# EAGLE design GB-BRK-F (EAGLE 7.3.0)
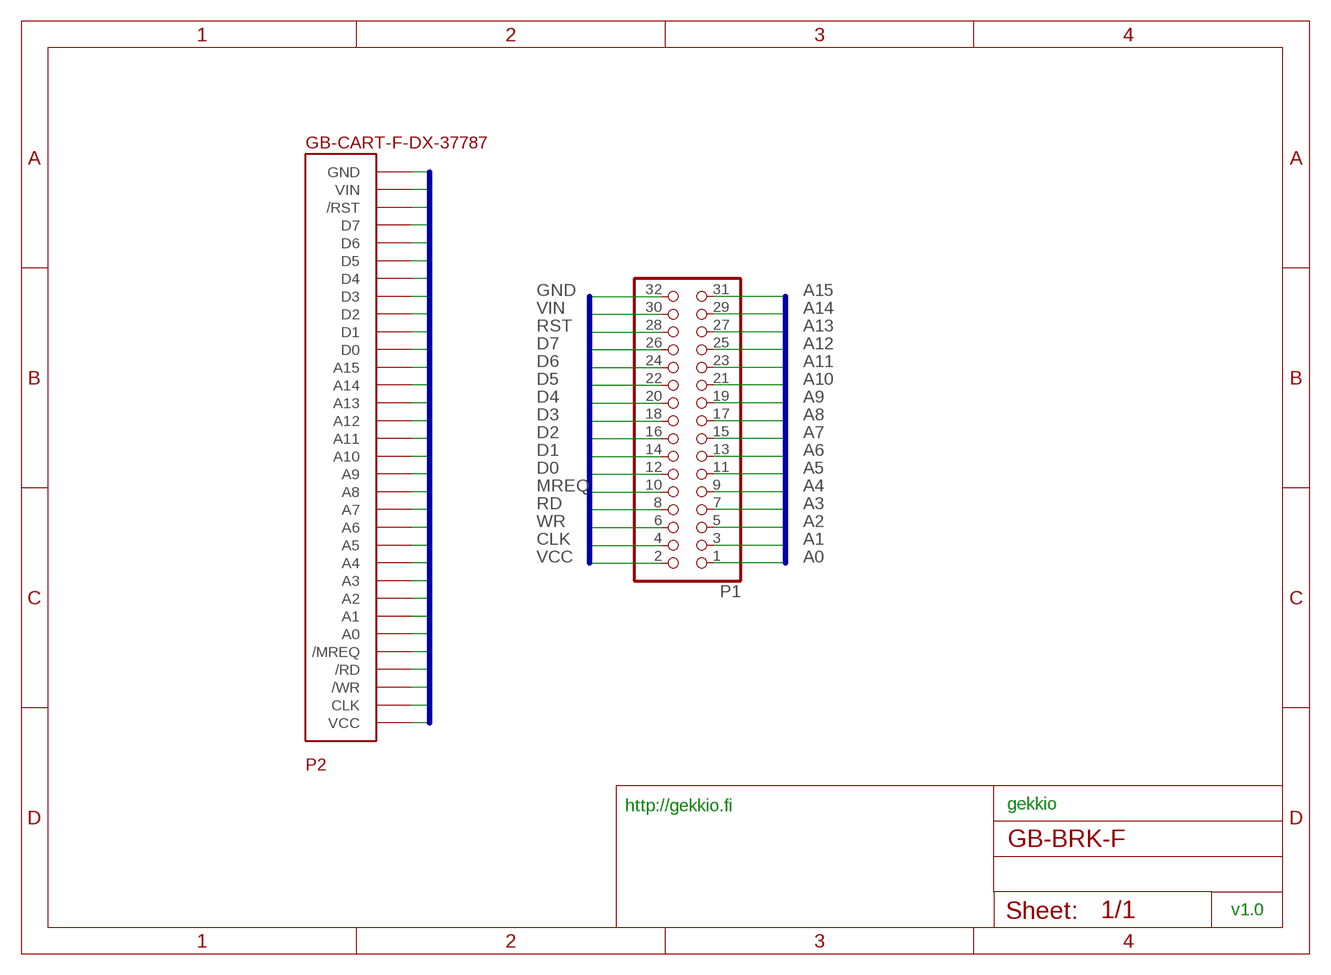
[diagram p0: schematic, sheet 1]

## Parts
P1  PINHD-2X16  [2X16]
P2  GB-CART-F-DX-37787  [DX-37787-GB]

## Nets
A0: P1.1 P2.6(A0)
A1: P1.3 P2.7(A1)
A2: P1.5 P2.8(A2)
A3: P1.7 P2.9(A3)
A4: P1.9 P2.10(A4)
A5: P1.11 P2.11(A5)
A6: P1.13 P2.12(A6)
A7: P1.15 P2.13(A7)
A8: P1.17 P2.14(A8)
A9: P1.19 P2.15(A9)
A10: P1.21 P2.16(A10)
A11: P1.23 P2.17(A11)
A12: P1.25 P2.18(A12)
A13: P1.27 P2.19(A13)
A14: P1.29 P2.20(A14)
A15: P1.31 P2.21(A15)
CLK: P1.4 P2.2(CLK)
D0: P1.12 P2.22(D0)
D1: P1.14 P2.23(D1)
D2: P1.16 P2.24(D2)
D3: P1.18 P2.25(D3)
D4: P1.20 P2.26(D4)
D5: P1.22 P2.27(D5)
D6: P1.24 P2.28(D6)
D7: P1.26 P2.29(D7)
GND: P1.32 P2.32(GND)
MREQ: P1.10 P2.5(/MREQ)
RD: P1.8 P2.4(/RD)
RST: P1.28 P2.30(/RST)
VCC: P1.2 P2.1(VCC)
VIN: P1.30 P2.31(VIN)
WR: P1.6 P2.3(/WR)

## Buses
VCC,CLK,WR,RD,MREQ,A[0..15],D[0..7],RST,VIN,GND

## Notes on the sheet
- http://gekkio.fi | gekkio
- v1.0

## Library data of the parts
P1 = pinhead:PINHD-2X16: PIN HEADER
P2 = Gameboy:GB-CART-F-DX-37787

## Board
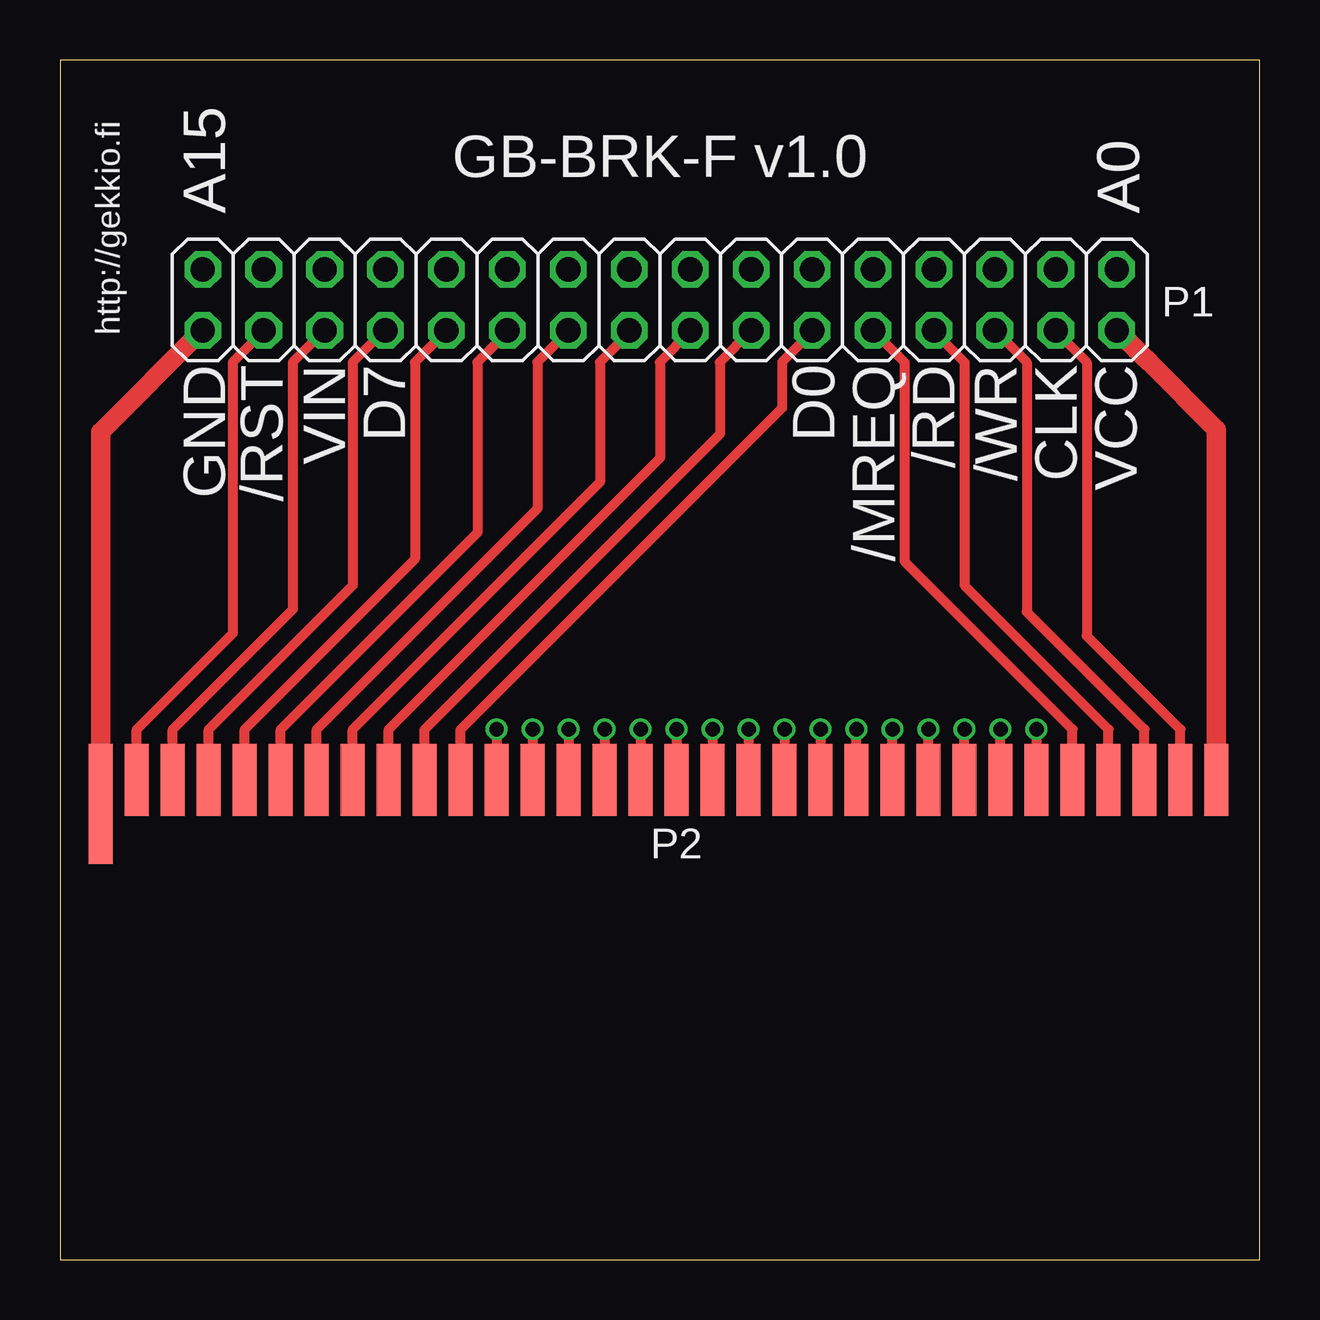
[diagram p1: board, top side]
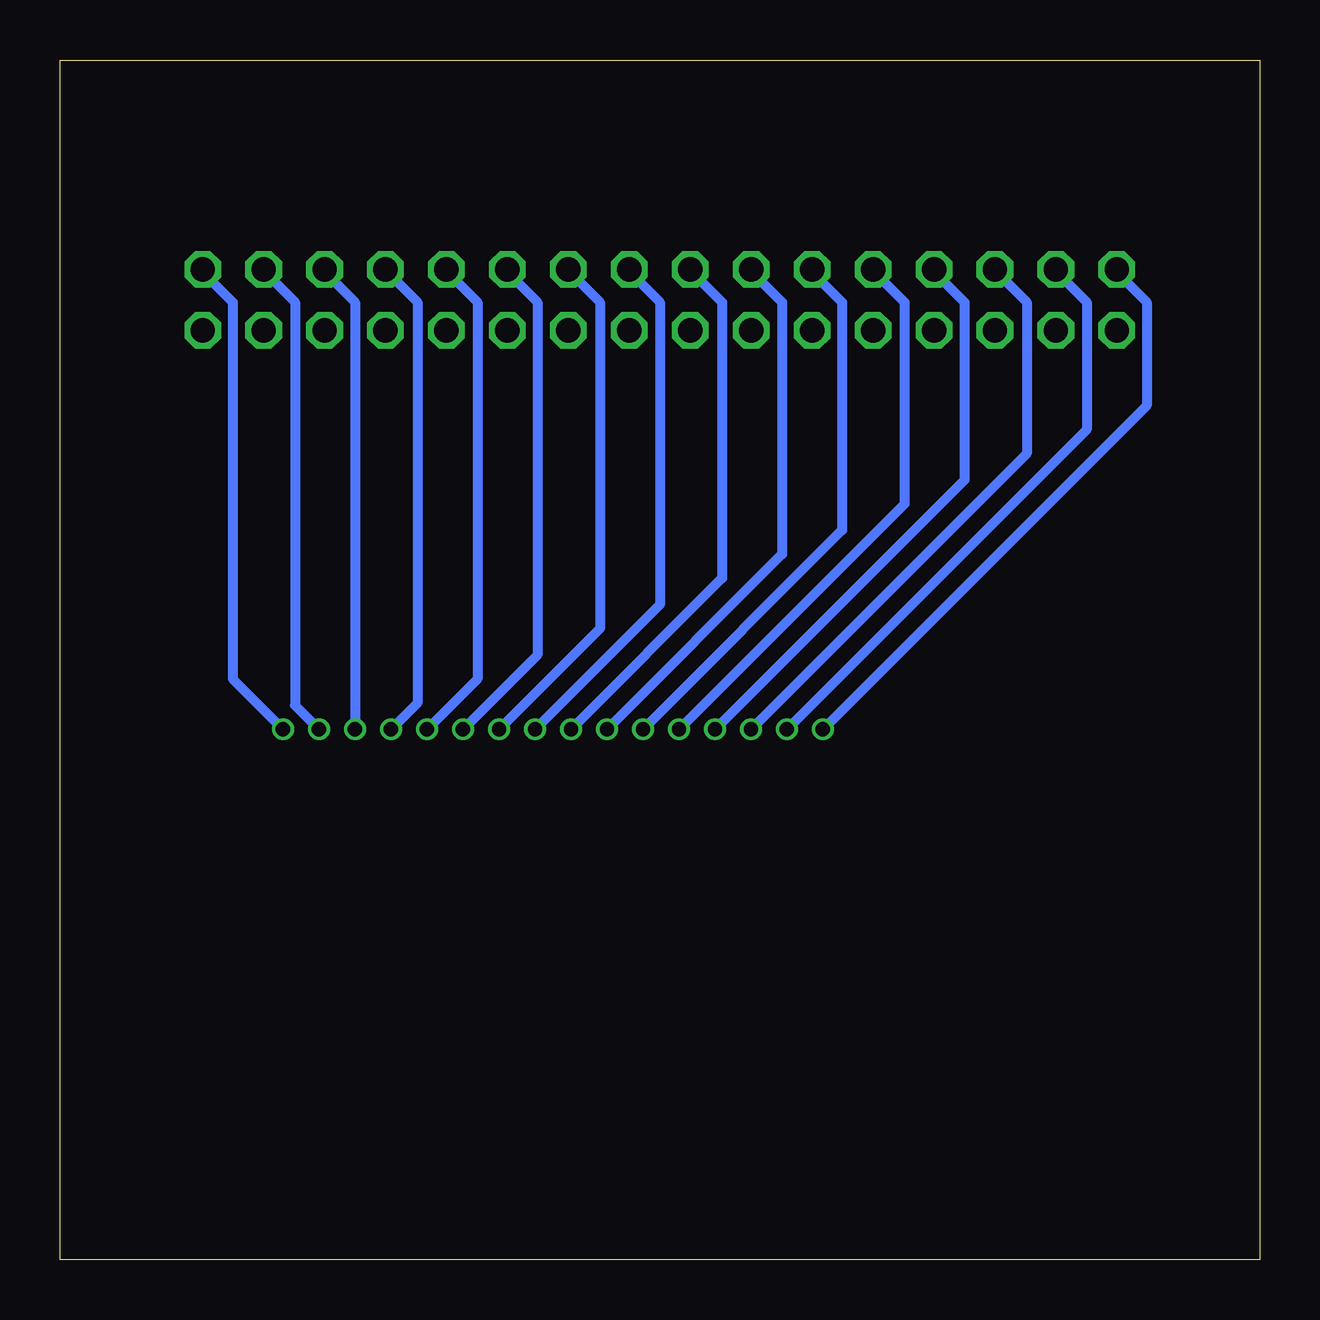
[diagram p2: board, bottom side, seen from below]

Size 50 x 50 mm. Coordinates in mm from the lower left corner, seen from the top.
Outline: 0,0 50,0 50,50 0,50 0,0
Copper layers (1*16): Top 0.035mm / dielectric 1.5mm / Bottom 0.035mm
Design rules "Elecrow_2-layer_eagle_rule *": minimum track width 6mil, minimum drill 12mil, track to track 6mil, track to pad 6mil, pad to pad 6mil, via to via 6mil, smd to smd 0mil, copper to edge 10mil, drill to drill 10mil, minimum pad ring 10mil, minimum via ring 6mil, stop-mask expansion 2mil, vias tented up to drill 100mil, thermal gap 10mil

### Footprints (pad centres in the part's own frame; a part is rotated, then mirrored left to right if it is on the bottom)
2X16 = drill 1.016 octagon: 1 -19.05,-1.27; 2 -19.05,1.27; 3 -16.51,-1.27; 4 -16.51,1.27; 5 -13.97,-1.27; 6 -13.97,1.27; 7 -11.43,-1.27; 8 -11.43,1.27; 9 -8.89,-1.27; 10 -8.89,1.27; 11 -6.35,-1.27; 12 -6.35,1.27; 13 -3.81,-1.27; 14 -3.81,1.27; 15 -1.27,-1.27; 16 -1.27,1.27; 17 1.27,-1.27; 18 1.27,1.27; 19 3.81,-1.27; 20 3.81,1.27; 21 6.35,-1.27; 22 6.35,1.27; 23 8.89,-1.27; 24 8.89,1.27; 25 11.43,-1.27; 26 11.43,1.27; 27 13.97,-1.27; 28 13.97,1.27; 29 16.51,-1.27; 30 16.51,1.27; 31 19.05,-1.27; 32 19.05,1.27
DX-37787-GB = smd 3 x 1: 1 0,22.5; 2 0,21; 3 0,19.5; 4 0,18; 5 0,16.5; 6 0,15; 7 0,13.5; 8 0,12; 9 0,10.5; 10 0,9; 11 0,7.5; 12 0,6; 13 0,4.5; 14 0,3; 15 0,1.5; 16 0,0; 17 0,-1.5; 18 0,-3; 19 0,-4.5; 20 0,-6; 21 0,-7.5; 22 0,-9; 23 0,-10.5; 24 0,-12; 25 0,-13.5; 26 0,-15; 27 0,-16.5; 28 0,-18; 29 0,-19.5; 30 0,-21; 31 0,-22.5 | smd 5 x 1: 32 1,-24

### Placement (x,y rotation side)
P1  25,40 180 top
P2  25.7,20 270 top

### Tracks (layer width: path | path; a pad name or v marks a point on that pad's centre or on a via)
A0  (via drill 0.6)
  Top 0.406: v40.7,22.1 P2.6
  Bottom 0.406: P1.1 44.05,41.15 42.8,39.9 42.8,24.2 v40.7,22.1
A1  (via drill 0.6)
  Top 0.406: P2.7 v39.2,22.1
  Bottom 0.406: P1.3 41.51,41.21 40.2,39.9 40.2,23.1 v39.2,22.1
A2  (via drill 0.6)
  Top 0.406: P2.8 v37.7,22.1
  Bottom 0.406: P1.5 38.97,41.17 37.7,39.9 v37.7,22.1
A3  (via drill 0.6)
  Top 0.406: P2.9 v36.2,22.1
  Bottom 0.406: P1.7 36.43,41.23 35.1,39.9 35.1,23.2 v36.2,22.1
A4  (via drill 0.6)
  Top 0.406: P2.10 v34.7,22.1
  Bottom 0.406: P1.9 33.89,41.19 32.6,39.9 32.6,24.2 v34.7,22.1
A5  (via drill 0.6)
  Top 0.406: P2.11 v33.2,22.1
  Bottom 0.406: P1.11 31.35,41.15 30.1,39.9 30.1,25.2 v33.2,22.1
A6  (via drill 0.6)
  Top 0.406: v31.7,22.1 P2.12
  Bottom 0.406: P1.13 28.81,41.21 27.5,39.9 27.5,26.3 v31.7,22.1
A7  (via drill 0.6)
  Top 0.406: v30.2,22.1 P2.13
  Bottom 0.406: P1.15 26.27,41.17 25,39.9 25,27.3 v30.2,22.1
A8  (via drill 0.6)
  Top 0.406: v28.7,22.1 P2.14
  Bottom 0.406: P1.17 23.73,41.23 22.4,39.9 22.4,28.4 v28.7,22.1
A9  (via drill 0.6)
  Top 0.406: v27.2,22.1 P2.15
  Bottom 0.406: P1.19 21.19,41.19 19.9,39.9 19.9,29.4 v27.2,22.1
A10  (via drill 0.6)
  Top 0.406: v25.7,22.1 P2.16
  Bottom 0.406: P1.21 18.65,41.15 17.4,39.9 17.4,30.4 v25.7,22.1
A11  (via drill 0.6)
  Top 0.406: v24.2,22.1 P2.17
  Bottom 0.406: P1.23 16.11,41.21 14.8,39.9 14.8,31.5 v24.2,22.1
A12  (via drill 0.6)
  Top 0.406: v22.7,22.1 P2.18
  Bottom 0.406: P1.25 13.57,41.17 12.3,39.9 12.3,32.5 v22.7,22.1
A13  (via drill 0.6)
  Top 0.406: v21.2,22.1 P2.19
  Bottom 0.406: P1.27 11.03,41.23 9.7,39.9 9.7,33.6 v21.2,22.1
A14  (via drill 0.6)
  Top 0.406: v19.7,22.1 P2.20
  Bottom 0.406: P1.29 8.49,41.19 7.2,39.9 7.2,34.6 v19.7,22.1
A15  (via drill 0.6)
  Top 0.406: v18.2,22.1 P2.21
  Bottom 0.406: P1.31 5.95,41.15 4.7,39.9 4.7,35.6 v18.2,22.1
CLK
  Top 0.406: P1.4 41.51,38.69 42.8,37.4 42.8,26 46.7,22.1 P2.2
D0
  Top 0.406: P1.12 31.35,38.65 30.1,37.4 30.1,35.5 16.7,22.1 P2.22
D1
  Top 0.406: P1.14 28.81,38.71 27.5,37.4 27.5,34.4 15.2,22.1 P2.23
D2
  Top 0.406: P1.16 26.27,38.67 25,37.4 25,33.4 13.7,22.1 P2.24
D3
  Top 0.406: P1.18 23.73,38.63 22.5,37.4 22.5,32.4 12.2,22.1 P2.25
D4
  Top 0.406: P1.20 21.19,38.69 19.9,37.4 19.9,31.3 10.7,22.1 P2.26
D5
  Top 0.406: P1.22 18.65,38.65 17.4,37.4 17.4,30.3 9.2,22.1 P2.27
D6
  Top 0.406: P1.24 16.11,38.71 14.8,37.4 14.8,29.2 7.7,22.1 P2.28
D7
  Top 0.406: P1.26 13.53,38.73 12.2,37.4 12.2,28.1 6.2,22.1 P2.29
GND
  Top 0.406: P1.32 5.93,38.73
  Top 0.813: P2.32 1.7,34.5 5.93,38.73
MREQ
  Top 0.406: P1.10 33.89,38.71 35.2,37.4 35.2,29.1 42.2,22.1 P2.5
RD
  Top 0.406: P1.8 36.43,38.67 37.7,37.4 37.7,28.1 43.7,22.1 P2.4
RST
  Top 0.406: P1.28 9.7,37.4 9.7,27.1 4.7,22.1 P2.30
VCC
  Top 0.406: P1.2 44.07,38.73
  Top 0.813: 44.07,38.73 45.05,37.75 45.4,37.4 48.2,34.6 P2.1
VIN
  Top 0.406: P1.30 8.49,38.69 7.2,37.4 7.2,26.1 3.2,22.1 P2.31
WR
  Top 0.406: P1.6 40.3,37.4 40.3,27 45.2,22.1 P2.3

### Text on the board
tPlace: GB-BRK-F v1.0 | A15 | A0 | http://gekkio.fi | GND | /RST | VIN | D7 | D0 | /MREQ | /RD | /WR | CLK | VCC